# EAGLE design BigClown_Sensor_adapter_v0.3 (EAGLE 9.2.2)
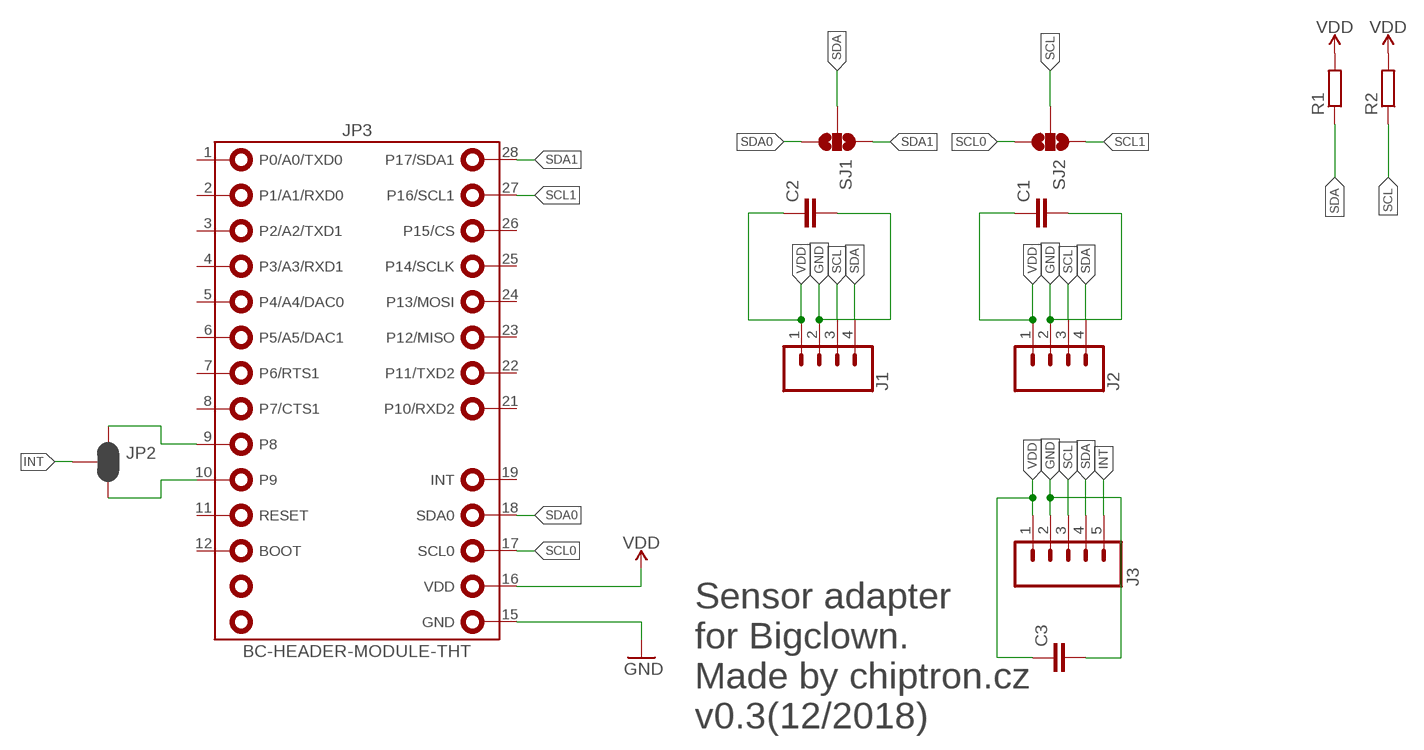
[diagram p0: schematic, sheet 1]

## Parts
C1  C-EUC0805  [C0805]
C2  C-EUC0805  [C0805]
C3  C-EUC0805  [C0805]
J1  CONN_04LONGPADS  [1X04_LONGPADS]
J2  CONN_04LONGPADS  [1X04_LONGPADS]
J3  M05PTH_LONGPADS  [1X05_LONGPADS]
JP2  JUMPER-SMT_3_2-NC_PASTE_SILK  [SMT-JUMPER_3_2-NC_PASTE_SILK]
JP3  BC-HEADER-MODULE-THT  [BC-HEADER-MODULE-THT]
R1  R-EU_M0805  [M0805]
R2  R-EU_M0805  [M0805]
SJ1  SOLDERJUMPER_2WAYS  [SJ_3]
SJ2  SOLDERJUMPER_2WAYS  [SJ_3]

## Nets
GND: C1.2 C2.2 C3.2 J1.2 J2.2 J3.2 JP3.15(GND)
INT: J3.5 JP2.2
N$1: JP2.3 JP3.10(P9)
N$2: JP2.1 JP3.9(P8)
SCL: J1.3 J2.3 J3.3 R2.1 SJ2.2
SCL0: JP3.17(SCL0) SJ2.3
SCL1: JP3.27(P16/SCL1) SJ2.1
SDA: J1.4 J2.4 J3.4 R1.1 SJ1.2
SDA0: JP3.18(SDA0) SJ1.3
SDA1: JP3.28(P17/SDA1) SJ1.1
VDD: C1.1 C2.1 C3.1 J1.1 J2.1 J3.1 JP3.16(VDD) R1.2 R2.2
Unconnected: JP3.1(P0/A0/TXD0) JP3.2(P1/A1/RXD03) JP3.3(P2/A2/TXD1) JP3.4(P3/A3/RXD1) JP3.5(P4/A4/DAC0) JP3.6(P5/A5/DAC1) JP3.7(P6/RTS1) JP3.8(P7/CTS1) JP3.11(RESET) JP3.12(BOOT) JP3.19(INT) JP3.21(P10/RXD2) JP3.22(P11/TXD2) JP3.23(P12/MISO) JP3.24(P13/MOSI) JP3.25(P14/SCLK) JP3.26(P15/CS)

## Notes on the sheet
- Sensor adapter 
  for Bigclown.
  Made by chiptron.cz
  v0.3(12/2018)

## Library data of the parts
C1-C3 = rcl:C-EU: CAPACITOR, European symbol; SPICEPREFIX: C
J1 J2 = SparkFun-Connectors:CONN_04: Multi connection point. Often used as Generic Header-pin footprint for 0.1 inch spaced/style header connections On any of the 0.1 inch spaced packages, you can populate with these: Break Away Headers - Straight <https://www.sparkfun.com/products/116> (PRT-00116) Break Away Male Headers - Right Angle <https://www.sparkfun.com/products/553> (PRT-00553) Female Headers <https://www.sparkfun.com/products/115> (PRT-00115) Break Away Headers - Machine Pin <https://www.sparkfun.com/products/117> (PRT-00117) Break Away Female Headers - Swiss Machine Pin <https://www.sparkfun.com/products/743> (PRT-00743) For SCREWTERMINALS and SPRING TERMINALS visit here: Screw Terimnals on SparkFun.com <https://www.sparkfun.com/search/results?term=Screw+Terminals> (5mm/3.5mm/2.54mm spacing) This device is also useful as a general connection point to wire up your design to another part of your project. Our various solder wires solder well into these plated through hole pads. Hook-Up Wire - Assortment (Stranded, 22 AWG) <https://www.sparkfun.com/products/11375> (PRT-11375) Hook-Up Wire - Assortment (Solid Core, 22 AWG) <https://www.sparkfun.com/products/11367> (PRT-11367) View the entire wire category on our website here <https://www.sparkfun.com/categories/141> Special notes: Molex polarized connector foot print use with SKU : PRT-08231 with associated crimp pins and housings. 1MM SMD Version SKU: PRT-10208; PROD_ID: CONN-09696
J3 = SparkFun:M05: Header 5 Standard 5-pin 0.1" header. Use with straight break away headers (SKU : PRT-00116), right angle break away headers (PRT-00553), swiss pins (PRT-00743), machine pins (PRT-00117), and female headers (PRT-00115). Molex polarized connector foot print use with SKU : PRT-08230 with associated crimp pins and housings.
JP2 = SparkFun-Jumpers:JUMPER-SMT_3_2-NC_PASTE: Normally closed solder jumper (2 of 2 connections) This jumper has an aperture in the stencil to allow solder paste to bridge both connections. Both connections are normally closed (NC). Wick off the solder to open the connection(s). Reapply solder to reclose the connection(s).
JP3 = bc-header:BC-HEADER-MODULE-THT: 14pin THT pin header or socket or long pin socket + 14pin THT pin header or socket or long pin socket empty pin 6 Use this pattern for THT connection only. Mounting Technology: THT; BCPN: -
R1 R2 = rcl:R-EU_: RESISTOR, European symbol; SPICEPREFIX: R
SJ1 SJ2 = SparkFun:SOLDERJUMPER_2WAY: Solder Jumper 2 way solder jumper

## Board
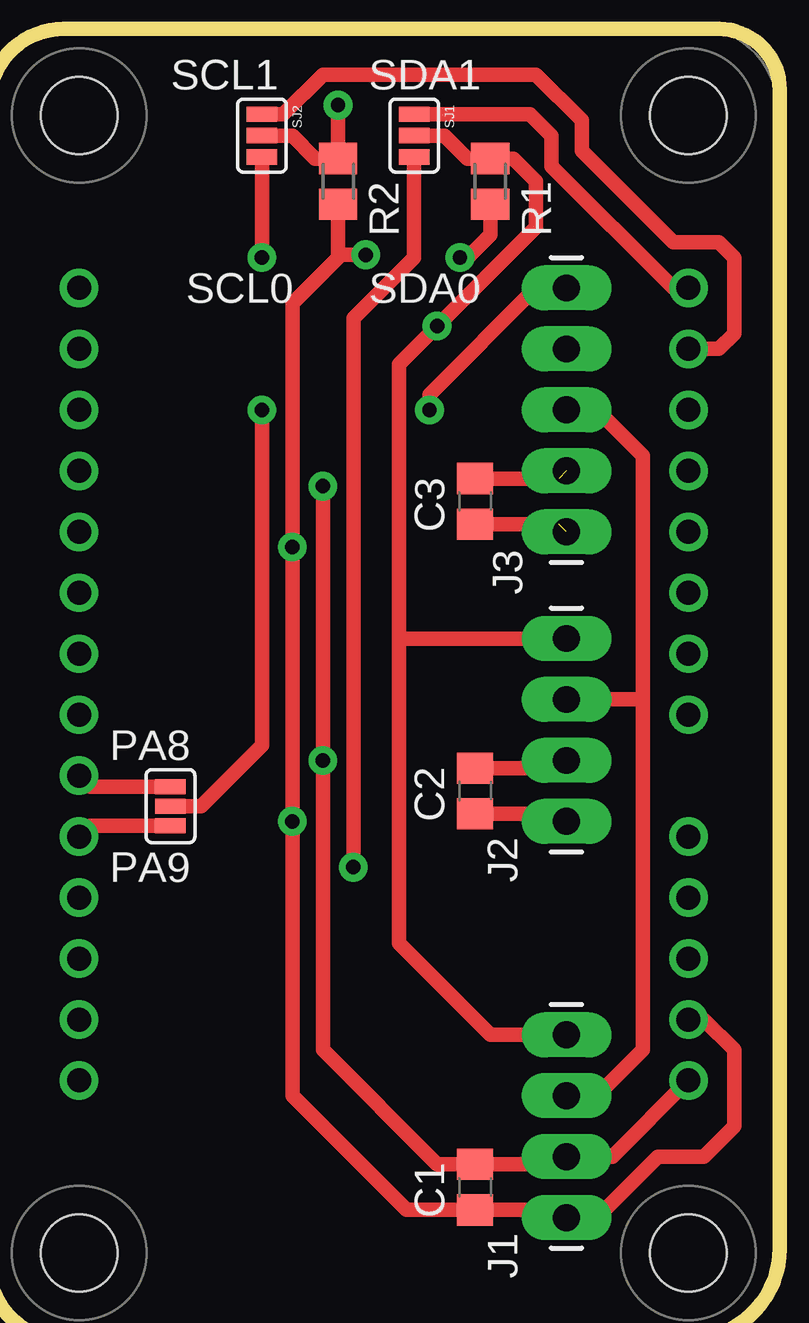
[diagram p1: board, top side]
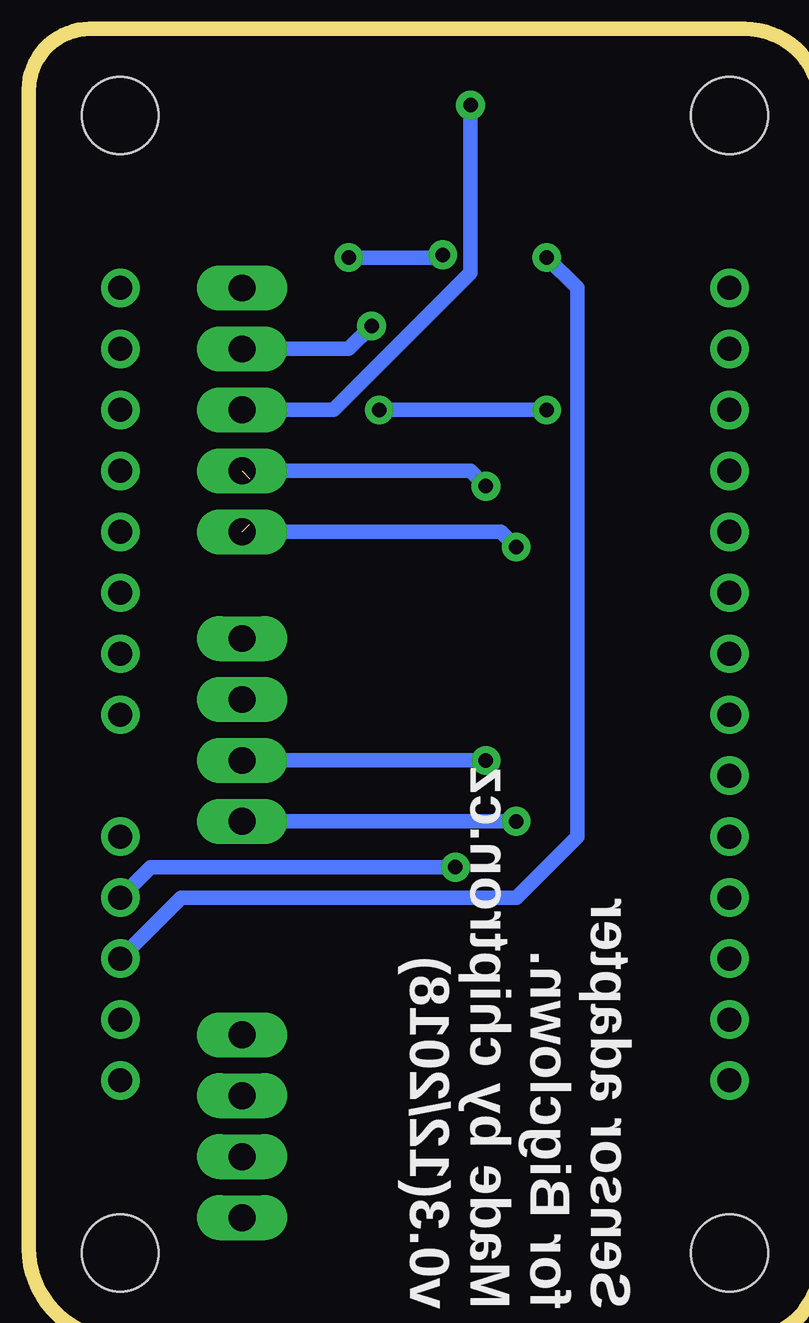
[diagram p2: board, bottom side, seen from below]

No outline drawn. Coordinates in mm, seen from the top.
Copper layers (1*16): Top 0.035mm / dielectric 1.5mm / Bottom 0.035mm
Design rules "default": minimum track width 6mil, minimum drill 0.35mm, track to track 6mil, track to pad 6mil, pad to pad 6mil, via to via 6mil, smd to smd 6mil, copper to edge 40mil, drill to drill 6mil, minimum pad ring 10mil, minimum via ring 8mil, stop-mask expansion 4mil, vias tented up to drill 0mil, thermal gap 10mil
Milling: 8 lines

### Footprints (pad centres in the part's own frame; a part is rotated, then mirrored left to right if it is on the bottom)
C0805 = smd 1.3 x 1.5: 1 -0.95,0; 2 0.95,0
1X04_LONGPADS = drill 1.118 pad 1.88 long: 1 0,0; 2 2.54,0; 3 5.08,0; 4 7.62,0
1X05_LONGPADS = drill 1.118 pad 1.88 long: 1 0,0; 2 2.54,0; 3 5.08,0; 4 7.62,0; 5 10.16,0
SMT-JUMPER_3_2-NC_PASTE_SILK = smd 0.635 x 1.27: 1 -0.813,0; 2 0,0; 3 0.813,0
BC-HEADER-MODULE-THT = drill 1 pad 1.6: 1 -12.7,16.51; 2 -12.7,13.97; 3 -12.7,11.43; 4 -12.7,8.89; 5 -12.7,6.35; 6 -12.7,3.81; 7 -12.7,1.27; 8 -12.7,-1.27; 9 -12.7,-3.81; 10 -12.7,-6.35; 11 -12.7,-8.89; 12 -12.7,-11.43; 13 -12.7,-13.97; 14 -12.7,-16.51; 15 12.7,-16.51; 16 12.7,-13.97; 17 12.7,-11.43; 18 12.7,-8.89; 19 12.7,-6.35; 21 12.7,-1.27; 22 12.7,1.27; 23 12.7,3.81; 24 12.7,6.35; 25 12.7,8.89; 26 12.7,11.43; 27 12.7,13.97; 28 12.7,16.51 | hole 3.2: -12.7,23.7; 12.7,23.7; -12.7,-23.7; 12.7,-23.7
M0805 = smd 1.3 x 1.6: 1 -0.95,0; 2 0.95,0
SJ_3 = smd 0.635 x 1.27: 1 -0.889,0; 2 0,0; 3 0.889,0

### Placement (x,y rotation side)
C1  22.86,9.53 90 top
C2  22.86,26.04 90 top
C3  22.86,38.1 90 top
J1  26.67,8.26 90 top
J2  26.67,24.77 90 top
J3  26.67,36.83 90 top
JP2  10.16,25.4 270 top
JP3  19.05,30.48 0 top
R1  23.5,51.44 270 top
R2  17.14,51.44 270 top
SJ1  20.32,53.34 270 top
SJ2  13.97,53.34 270 top

### Tracks (layer width: path | path; a pad name or v marks a point on that pad's centre or on a via)
GND  (via drill 0.6 pad 1.2)  (1 unrouted)
  Top 0.61: 26.35,39.05 C3.2 | C2.2 26.35,26.98 J2.2 | v16.51,38.73 v16.51,27.3 16.51,15.24 21.27,10.47 C1.2 26.35,10.47 J1.2 28.57,10.79 JP3.15
  Bottom 0.61: J2.2 v16.51,27.3 | v16.51,38.73 17.14,39.37 J3.2
INT  (via drill 0.6 pad 1.2)
  Top 0.61: JP2.2 11.43,25.4 13.97,27.94 v13.97,41.91 | v20.95,41.91 20.95,42.55 25.4,46.99 J3.5
  Bottom 0.61: v13.97,41.91 v20.95,41.91
N$1
  Top 0.61: JP2.3 6.81,24.59 JP3.10
N$2
  Top 0.61: JP2.1 6.81,26.21 JP3.9
SCL  (via drill 0.6 pad 1.2)
  Top 0.61: 29.84,29.84 29.84,40.01 27.94,41.91 J3.3 | 29.84,29.84 29.84,15.24 27.94,13.34 J1.3 | 17.14,52.7 R2.1 | R2.1 v17.14,54.61 | SJ2.2 15.24,53.34 16.2,52.38 R2.1 | J2.3 29.84,29.84
  Bottom 0.61: v17.14,54.61 17.14,47.62 22.86,41.91 J3.3
SCL0  (via drill 0.6 pad 1.2)
  Top 0.61: v13.97,48.26 SJ2.3
  Bottom 0.61: v13.97,48.26 12.7,46.99 12.7,24.13 15.24,21.59 29.21,21.59 JP3.17
SCL1
  Top 0.61: SJ2.1 14.86,54.23 16.51,55.88 25.4,55.88 27.3,53.98 27.3,52.7 31.11,48.9 33.02,48.9 33.66,48.26 33.66,45.09 33.02,44.45 JP3.27
SDA  (via drill 0.6 pad 1.2)
  Top 0.61: 23.5,52.7 R1.1 | 19.68,32.38 19.68,43.81 v21.27,45.4 25.4,49.53 25.4,51.44 24.45,52.38 R1.1 | 19.68,32.38 19.68,19.68 23.5,15.88 J1.4 | J2.4 19.68,32.38 | SJ1.2 21.59,53.34 22.55,52.38 R1.1
  Bottom 0.61: J3.4 22.23,44.45 v21.27,45.4
SDA0  (via drill 0.6 pad 1.2)
  Top 0.61: SJ1.3 20.32,48.26 17.78,45.72 v17.78,22.86
  Bottom 0.61: v17.78,22.86 30.48,22.86 JP3.18
SDA1
  Top 0.61: SJ1.1 25.15,54.23 26.04,53.34 26.04,52.07 31.11,46.99 JP3.28
VDD  (via drill 0.6 pad 1.2)  (1 unrouted)
  Top 0.61: C3.1 26.35,37.15 | C2.1 26.35,25.09 J2.1 | 17.14,48.26 17.26,48.37 v18.3,48.37 | 17.14,48.26 R2.2 | v22.23,48.26 22.54,48.26 23.5,49.22 R1.2 | 17.14,48.26 15.24,46.35 v15.24,36.2 v15.24,24.77 15.24,13.34 20,8.57 C1.1 26.35,8.57 J1.1 27.94,8.26 30.48,10.79 32.38,10.79 33.66,12.06 33.66,15.24 32.38,16.51 JP3.16
  Bottom 0.61: J2.1 v15.24,24.77 | v22.23,48.26 18.41,48.26 v18.3,48.37 | J3.1 15.88,36.83 v15.24,36.2

### Text on the board
tNames: SCL1 | SDA1 | SCL0 | SDA0 | PA8 | PA9
bNames: Sensor adapter / for Bigclown. / Made by chiptron.cz / v0.3(12/2018)